# EAGLE design untitled (EAGLE 9.6.2)
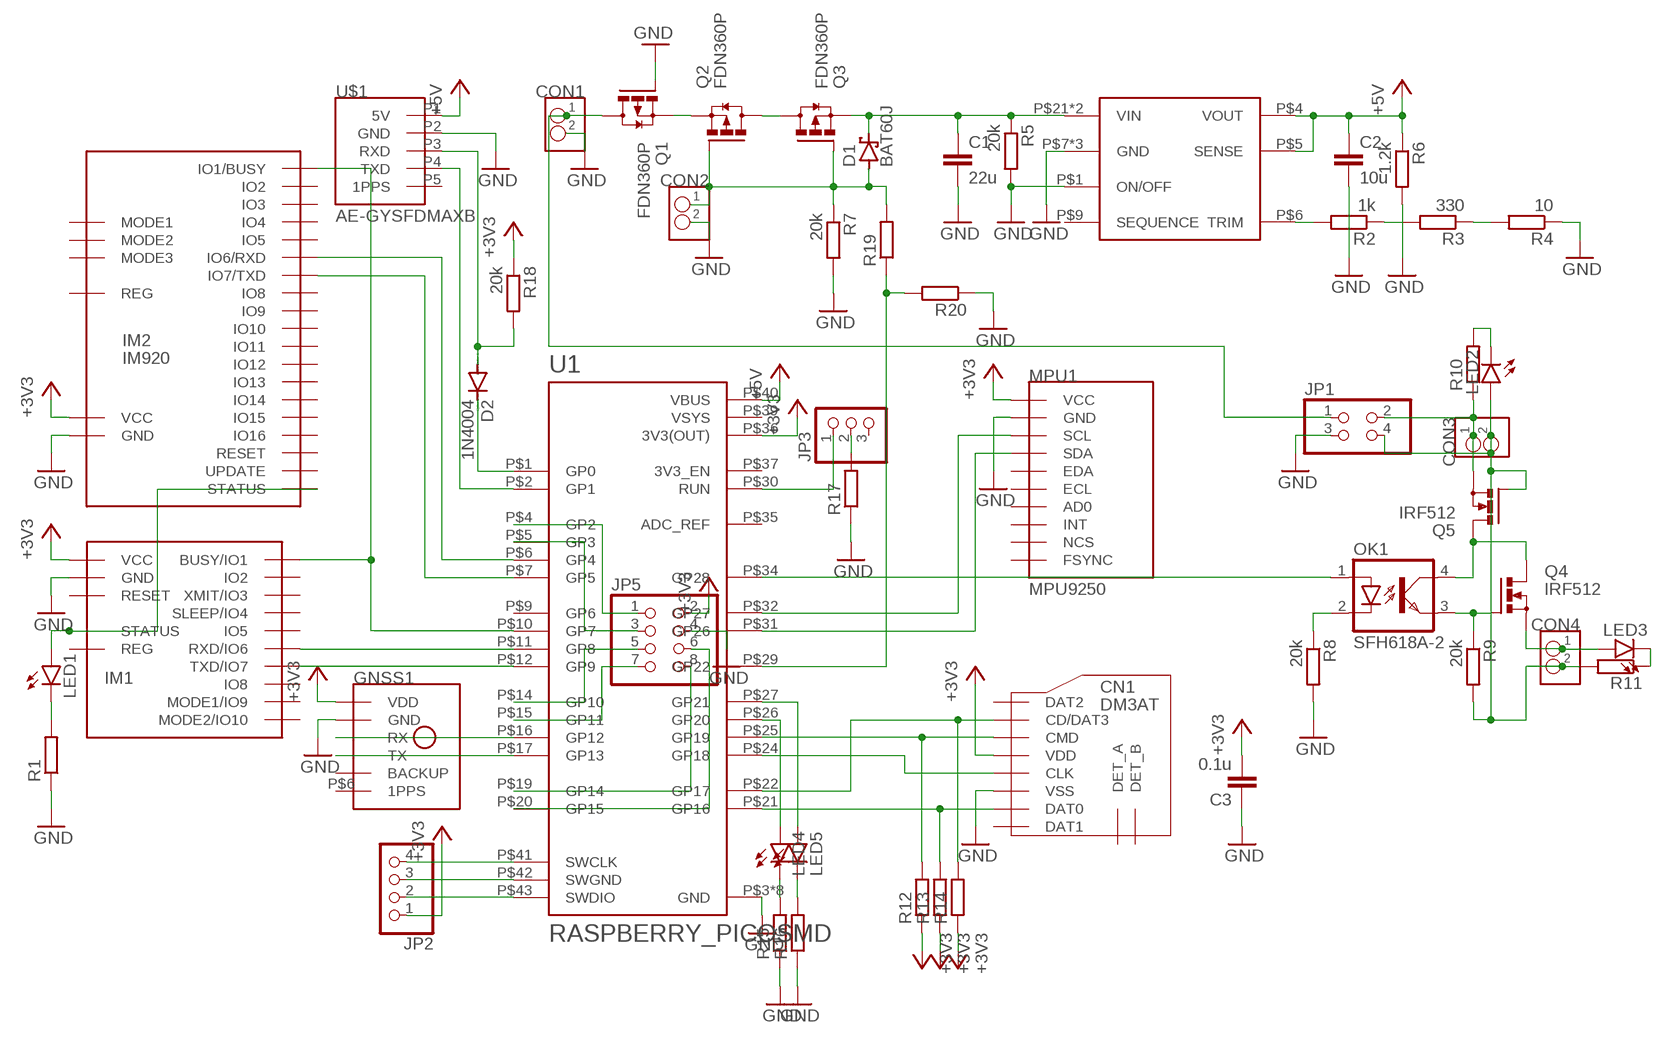
[diagram p0: schematic, sheet 1]

## Parts
C1  22u  C-EUC0805  [C0805]
C2  10u  C-EUC0805  [C0805]
C3  0.1u  C-EUC0805  [C0805]
CN1  DM3AT  [DM3AT]
CON1  B2B-XH-A  [B2B-XH-A]
CON2  B2B-XH-A  [B2B-XH-A]
CON3  B2B-XH-A  [B2B-XH-A]
CON4  B2B-XH-A  [B2B-XH-A]
D1  BAT60J  [SOD323_ST]
D2  1N4004  [DO41-10]
GNSS1  GYSFDMAXB  [GYSFDMAXB]
I1  ＯＫＬ-Ｔ/３-Ｗ５Ｎ-Ｃ  [ＯＫＬ-Ｔ/３-Ｗ５Ｎ-Ｃ]
IM1  IM920C  [IM920C]
IM2  IM920  [IM920]
JP1  PINHD-2X2  [2X02]
JP2  PINHD-1X4  [1X04]
JP3  PINHD-1X3  [1X03]
JP5  PINHD-2X4  [2X04]
LED1  LEDCHIP-LED0805  [CHIP-LED0805]
LED2  LEDCHIP-LED0805  [CHIP-LED0805]
LED3  LEDCHIP-LED0805  [CHIP-LED0805]
LED4  LEDCHIP-LED0805  [CHIP-LED0805]
LED5  LEDCHIP-LED0805  [CHIP-LED0805]
MPU1  MPU9250  [GY-9250]
OK1  SFH618A-2  [DIP4]
Q1  FDN360P  [SUPER-SOT3]
Q2  FDN360P  [SUPER-SOT3]
Q3  FDN360P  [SUPER-SOT3]
Q4  IRF512  [TO220BV]
Q5  IRF512  [TO220BV]
R1  R-EU_R0603  [R0603]
R2  1k  R-EU_R0603  [R0603]
R3  330  R-EU_R0603  [R0603]
R4  10  R-EU_R0603  [R0603]
R5  20k  R-EU_R0603  [R0603]
R6  1.2k  R-EU_R0603  [R0603]
R7  20k  R-EU_R0603  [R0603]
R8  20k  R-EU_R0603  [R0603]
R9  20k  R-EU_R0603  [R0603]
R10  R-EU_R0603  [R0603]
R11  R-EU_R0603  [R0603]
R12  R-EU_R0603  [R0603]
R13  R-EU_R0603  [R0603]
R14  R-EU_R0603  [R0603]
R15  R-EU_R0603  [R0603]
R16  R-EU_R0603  [R0603]
R17  R-EU_R0603  [R0603]
R18  20k  R-EU_R0603  [R0603]
R19  R-EU_R0603  [R0603]
R20  R-EU_R0603  [R0603]
U1  RASPBERRY_PICOSMD  [PICO-PKG-SMD]
U$1  AE-GYSFDMAXB  [AE-GYSFDMAXB]

## Nets
+3V3 [supply]: C3.2 CN1.VDD GNSS1.P$16(VDD) IM1.$P17(VCC) IM2.IO23(VCC) JP2.1 JP5.2 MPU1.P1(VCC) R12.1 R13.1 R14.1 R18.1 U1.P$36(3V3(OUT))
+5V [supply]: C2.1 I1.P$4(VOUT) I1.P$5(SENSE) R6.1 U1.P$40(VBUS) U$1.P1(5V)
GND [supply]: C1.2 C2.2 C3.1 CN1.VSS CON1.P$2 CON2.P$2 GNSS1.P$1(GND) GNSS1.P$2(GND) GNSS1.P$7(GND) GNSS1.P$10(GND) GNSS1.P$12(GND) GNSS1.P$19(GND) GNSS1.P$20(GND) I1.P$1(ON/OFF) I1.P$7(GND) I1.P$31(GND) I1.P$32(GND) IM1.$P18(GND) IM2.IO24(GND) JP1.3 JP5.4 MPU1.P2(GND) Q1.1(G) R1.1 R4.1 R5.2 R6.2 R7.2 R8.2 R15.1 R16.1 R17.1 R20.1 U1.P$3(GND) U1.P$8(GND) U1.P$13(GND) U1.P$18(GND) U1.P$23(GND) U1.P$28(GND) U1.P$33(GND) U1.P$38(GND) U$1.P2(GND)
N$1: CN1.CLK U1.P$24(GP18)
N$2: CN1.DAT0 R13.2 U1.P$21(GP16)
N$3: CN1.CMD R12.2 U1.P$25(GP19)
N$4: CN1.CD/DAT3 R14.2 U1.P$22(GP17)
N$5: MPU1.P4(SDA) U1.P$31(GP26)
N$6: MPU1.P3(SCL) U1.P$32(GP27)
N$7: GNSS1.P$3(RX) U1.P$16(GP12)
N$8: GNSS1.P$5(TX) U1.P$17(GP13)
N$9: IM1.$P6(RXD/IO6) U1.P$11(GP8)
N$10: IM1.$P7(TXD/IO7) U1.P$12(GP9)
N$11: LED1.C R1.2
N$12: IM1.$P15(STATUS) IM2.IO21(STATUS) LED1.A
N$13: IM1.$P1(BUSY/IO1) IM2.IO1(IO1/BUSY) U1.P$10(GP7)
N$14: IM2.IO6(IO6/RXD) U1.P$6(GP4)
N$15: IM2.IO7(IO7/TXD) U1.P$7(GP5)
N$16: U1.P$2(GP1) U$1.P4(TXD)
N$17: D2.C U1.P$1(GP0)
N$18: R2.1 R3.2
N$19: I1.P$6(TRIM) R2.2
N$20: R3.1 R4.2
N$21: CON1.P$1 JP1.1 Q1.3(D)
N$22: C1.1 D1.C I1.P$21(VIN) I1.P$22(VIN) Q3.2(S) R5.1
N$23: Q1.2(S) Q2.2(S)
N$24: Q2.3(D) Q3.3(D)
N$25: R19.1 R20.2 U1.P$29(GP22)
N$26: OK1.2(C) R8.1
N$27: OK1.3(EMIT) Q4.G R9.1
N$28: CON4.P$1 LED3.A Q4.S
N$29: CON3.P$1 JP1.2 Q5.S R10.1
N$30: OK1.4(COL) Q4.D Q5.D
N$31: OK1.1(A) U1.P$34(GP28)
N$32: CON3.P$2 CON4.P$2 JP1.4 LED2.A Q5.G R9.2 R11.2
N$33: LED3.C R11.1
N$34: LED2.C R10.2
N$35: JP2.2 U1.P$43(SWDIO)
N$36: JP2.3 U1.P$42(SWGND)
N$37: JP2.4 U1.P$41(SWCLK)
N$38: JP5.6 U1.P$20(GP15)
N$39: JP5.8 U1.P$19(GP14)
N$40: JP5.7 U1.P$15(GP11)
N$41: JP5.5 U1.P$14(GP10)
N$42: JP5.3 U1.P$5(GP3)
N$43: JP5.1 U1.P$4(GP2)
N$44: LED4.A U1.P$26(GP20)
N$45: LED5.A U1.P$27(GP21)
N$46: LED4.C R15.2
N$47: LED5.C R16.2
N$48: JP3.1 U1.P$30(RUN)
N$49: JP3.2 R17.2
N$50: D2.A R18.2 U$1.P3(RXD)
N$51: CON2.P$1 D1.A Q2.1(G) Q3.1(G) R7.1 R19.2
Unconnected: CN1.DAT1 CN1.DAT2 CN1.DET_A CN1.DET_B GNSS1.P$6(1PPS) GNSS1.P$14(BACKUP) I1.P$9(SEQUENCE) IM1.$P2(IO2) IM1.$P3(XMIT/IO3) IM1.$P4(SLEEP/IO4) IM1.$P5(IO5) IM1.$P8(IO8) IM1.$P9(MODE1/IO9) IM1.$P10(MODE2/IO10) IM1.$P16(REG) IM1.$P19(RESET) IM2.IO2 IM2.IO3 IM2.IO4 IM2.IO5 IM2.IO8 IM2.IO9 IM2.IO10 IM2.IO11 IM2.IO12 IM2.IO13 IM2.IO14 IM2.IO15 IM2.IO16 IM2.IO17(MODE1) IM2.IO18(MODE2) IM2.IO19(MODE3) IM2.IO20(UPDATE) IM2.IO22(REG) IM2.IO25(RESET) JP3.3 MPU1.P5(EDA) MPU1.P6(ECL) MPU1.P7(AD0) MPU1.P8(INT) MPU1.P9(NCS) MPU1.P10(FSYNC) U1.P$9(GP6) U1.P$35(ADC_REF) U1.P$37(3V3_EN) U$1.P5(1PPS)

## Power pins joined to a net without a drawn wire
VSYS: U1.P$39(VSYS)

## Library data of the parts
C1-C3 = rcl:C-EU: CAPACITOR, European symbol; SPICEPREFIX: C
CN1 = microSD:DM3AT
CON1-CON4 = xh2-jst-con:B2B-XH-A
D1 = diode:BAT60J: Schottky barrier diode Source: www.st.com, BAT60J.pdf
D2 = diode:1N4004: DIODE general purpose rectifier, 1 A
GNSS1 = GYSFDMAXB:GYSFDMAXB
I1 = untitled:ＯＫＬ-Ｔ/３-Ｗ５Ｎ-Ｃ
IM1 = IM920:IM920C
IM2 = IM920:IM920
JP1 = pinhead:PINHD-2X2: PIN HEADER
JP2 = pinhead:PINHD-1X4: PIN HEADER
JP3 = pinhead:PINHD-1X3: PIN HEADER
JP5 = pinhead:PINHD-2X4: PIN HEADER
LED1-LED5 = led:LED: LED OSRAM: - CHIPLED LG R971, LG N971, LY N971, LG Q971, LY Q971, LO R971, LY R971 LH N974, LH R974 LS Q976, LO Q976, LY Q976 LO Q996 - Hyper CHIPLED LW Q18S LB Q993, LB Q99A, LB R99A - SideLED LS A670, LO A670, LY A670, LG A670, LP A670 LB A673, LV A673, LT A673, LW A673 LH A674 LY A675 LS A676, LA A676, LO A676, LY A676, LW A676 LS A679, LY A679, LG A679 - Hyper Micro SIDELED® LS Y876, LA Y876, LO Y876, LY Y876 LT Y87S - SmartLED LW L88C, LW L88S LB L89C, LB L89S, LG L890 LS L89K, LO L89K, LY L89K LS L896, LA L896, LO L896, LY L896 - TOPLED LS T670, LO T670, LY T670, LG T670, LP T670 LSG T670, LSP T670, LSY T670, LOP T670, LYG T670 LG T671, LOG T671, LSG T671 LB T673, LV T673, LT T673, LW T673 LH T674 LS T676, LA T676, LO T676, LY T676, LB T676, LH T676, LSB T676, LW T676 LB T67C, LV T67C, LT T67C, LS T67K, LO T67K, LY T67K, LW E67C LS E67B, LA E67B, LO E67B, LY E67B, LB E67C, LV E67C, LT E67C LW T67C LS T679, LY T679, LG T679 LS T770, LO T770, LY T770, LG T770, LP T770 LB T773, LV T773, LT T773, LW T773 LH T774 LS E675, LA E675, LY E675, LS T675 LS T776, LA T776, LO T776, LY T776, LB T776 LHGB T686 LT T68C, LB T68C - Hyper Mini TOPLED® LB M676 - Mini TOPLED Santana® LG M470 LS M47K, LO M47K, LY M47K Source: http://www.osram.convergy.de LUXEON: - LUMILED® LXK2-PW12-R00, LXK2-PW12-S00, LXK2-PW14-U00, LXK2-PW14-V00 LXK2-PM12-R00, LXK2-PM12-S00, LXK2-PM14-U00 LXK2-PE12-Q00, LXK2-PE12-R00, LXK2-PE12-S00, LXK2-PE14-T00, LXK2-PE14-U00 LXK2-PB12-K00, LXK2-PB12-L00, LXK2-PB12-M00, LXK2-PB14-N00, LXK2-PB14-P00, LXK2-PB14-Q00 LXK2-PR12-L00, LXK2-PR12-M00, LXK2-PR14-Q00, LXK2-PR14-R00 LXK2-PD12-Q00, LXK2-PD12-R00, LXK2-PD12-S00 LXK2-PH12-R00, LXK2-PH12-S00 LXK2-PL12-P00, LXK2-PL12-Q00, LXK2-PL12-R00 Source: www.luxeon.com KINGBRIGHT: KA-3528ASYC Source: www.kingbright.com
MPU1 = MPU9250:MPU9250
OK1 = optocoupler:SFH618?*: Optocoupler, Phototransistor Output, Low Input Current Source: Data sheet <http://www.vishay.com/docs/83673/sfh618.pdf>; MF: VISHAY/TELEFUNKEN; MPN: SFH618A-2; OC_FARNELL: 6424855; OC_NEWARK: 21H7744
Q1-Q3 = transistor-power:FDN360P: Single P-Channel, PowerTrench (R) MOSFET Source: http://www.fairchildsemi.com/ds/FD/FDN360P.pdf
Q4 Q5 = transistor-power:IRF512: N-CHANNEL MOS FET
R1-R20 = rcl:R-EU_: RESISTOR, European symbol; SPICEPREFIX: R
U1 = RpiPico:RASPBERRY_PICO: Raspberry Pi Pico
U$1 = AE-GYSFDMAXB:AE-GYSFDMAXB

## Net classes
1 supply: width 0.305 mm

## Board
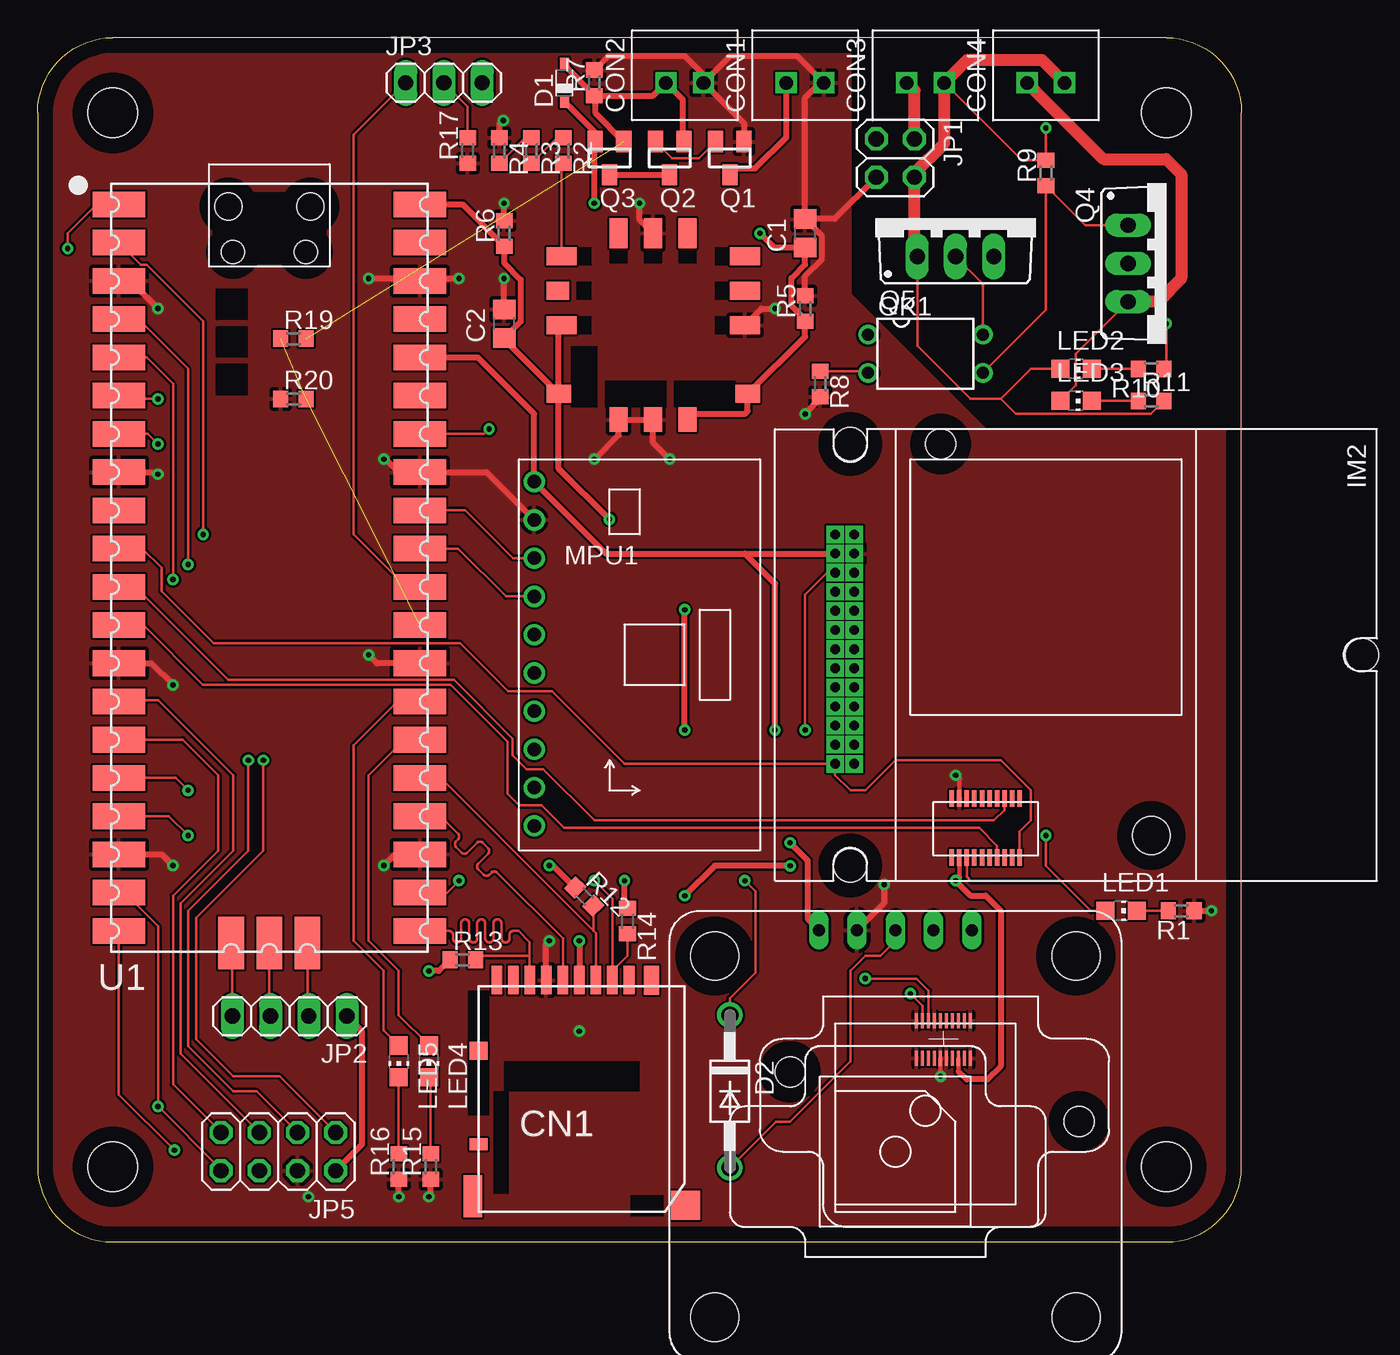
[diagram p1: board, top side]
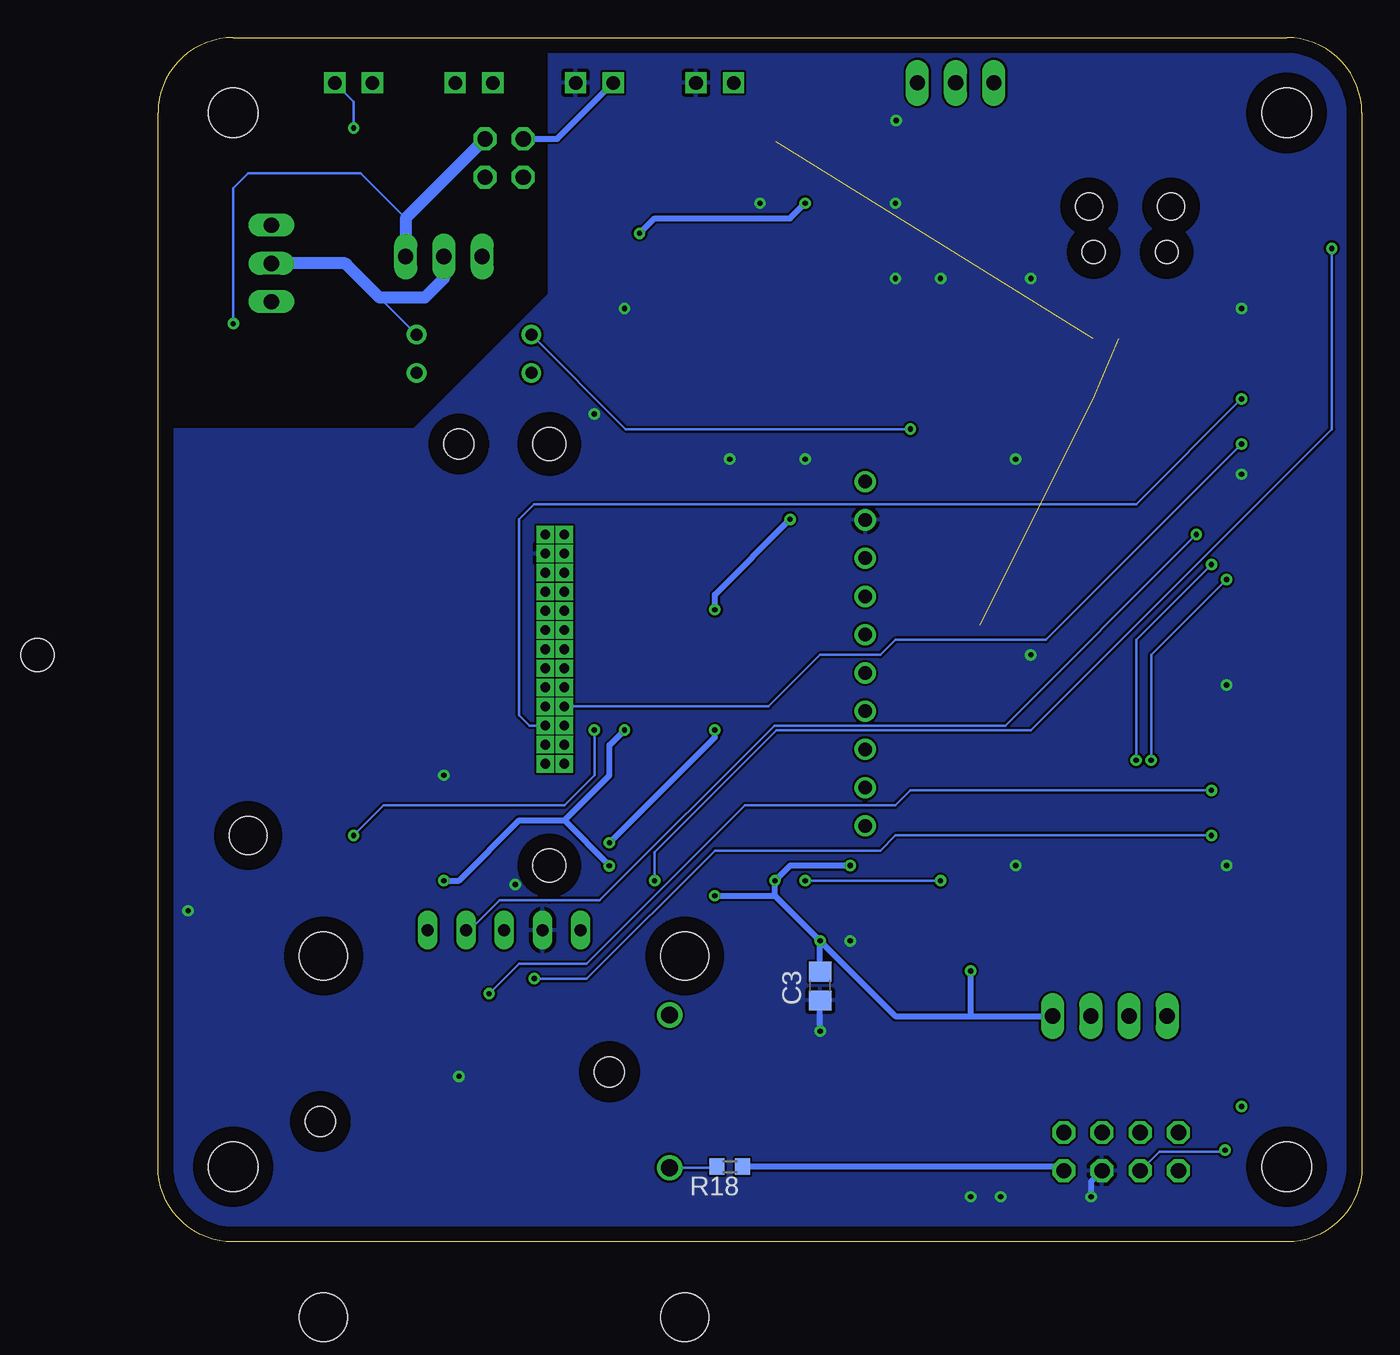
[diagram p2: board, bottom side, seen from below]

Size 80 x 80 mm. Coordinates in mm from the lower left corner, seen from the top.
Outline: 5,0 75,0 arc90 80,5 80,75 arc90 75,80 5,80 arc90 0,75 0,5 arc90 5,0
Copper layers (1*16): Top 0.035mm / dielectric 1.5mm / Bottom 0.035mm
Design rules "default": minimum track width 6mil, minimum drill 0.35mm, track to track 6mil, track to pad 6mil, pad to pad 6mil, via to via 6mil, smd to smd 6mil, copper to edge 40mil, drill to drill 6mil, minimum pad ring 10mil, minimum via ring 8mil, stop-mask expansion 4mil, vias tented up to drill 0mil, thermal gap 10mil
Holes 3.3 mm at 5,75 5,5 75,5 75,75

### Footprints (pad centres in the part's own frame; a part is rotated, then mirrored left to right if it is on the bottom)
C0805 = smd 1.3 x 1.5: 1 -0.95,0; 2 0.95,0
DM3AT = smd 0.7 x 1.9: CD/DAT3 2.2,6.4; CLK -1.1,6.4; CMD 1.1,6.4; DAT0 -3.3,6.4; DAT1 -4.4,6.4; DAT2 3.3,6.4; DET_B -5.5,6.4; VDD 0,6.4; VSS -2.2,6.4 | smd 1.2 x 0.8: DET_A -6.7,-4.5 | smd 1 x 1.9: P$9 4.8,6.381 | smd 1.2 x 1.2: P$11 -6.7,1.7 | smd 1.2 x 2.8: P$13 -7.081,-7.973 | smd 1.9 x 1.9: P$14 7.054,-8.562
B2B-XH-A = drill 0.9 square: P$1 0,1.25; P$2 0,-1.25
SOD323_ST = smd 0.8 x 0.6: A 1.25,0; C -1.25,0
DO41-10 = drill 1.118: A 5.08,0; C -5.08,0
GYSFDMAXB = smd 0.2 x 1: P$1 8.4,6.7; P$2 8.4,4.2; P$3 8.8,6.7; P$4 8.8,4.2; P$5 9.2,6.7; P$6 9.2,4.2; P$7 9.6,6.7; P$8 9.6,4.2; P$9 10,6.7; P$10 10,4.2; P$11 10.4,6.7; P$12 10.4,4.2; P$13 10.8,6.7; P$14 10.8,4.2; P$15 11.2,6.7; P$16 11.2,4.2; P$17 11.6,6.7; P$18 11.6,4.2; P$19 12,6.7; P$20 12,4.2 | hole 2: 0,3.3; 19.2,0
ＯＫＬ-Ｔ/３-Ｗ５Ｎ-Ｃ = smd 2 x 1.2: P$1 0,6.1; P$5 12.19,6.1; P$6 12.19,1.52; P$9 0,1.52; P$10 0,3.81 | smd 1.63 x 1.2: P$4 12.375,10.67; P$21 -0.185,10.67 | smd 1.2 x 2: P$7 6.1,0; P$8 3.81,0; P$12 8.39,0 | smd 1.5 x 1.2: P$11 12.44,3.81 | smd 1.2 x 1.63: P$22 3.81,12.375; P$31 6.1,12.375; P$32 8.39,12.375
IM920C = smd 0.3 x 1.1: $P1 -1.75,-13.45; $P2 -1.75,-9.55; $P3 -2.25,-13.45; $P4 -2.25,-9.55; $P5 -2.75,-13.45; $P6 -2.75,-9.55; $P7 -3.25,-13.45; $P8 -3.25,-9.55; $P9 -3.75,-13.45; $P10 -3.75,-9.55; $P11 -4.25,-13.45; $P12 -4.25,-9.55; $P13 -4.75,-13.45; $P14 -4.75,-9.55; $P15 -5.25,-13.45; $P16 -5.25,-9.55; $P17 -5.75,-13.45; $P18 -5.75,-9.55; $P19 -6.25,-13.45; $P20 -6.25,-9.55 | hole 2.5: 7,-12 | hole 2: -7,14
IM920 = drill 0.65 square: IO1 7.24,-16; IO2 7.24,-14.73; IO3 5.97,-16; IO4 5.97,-14.73; IO5 4.7,-16; IO6 4.7,-14.73; IO7 3.43,-16; IO8 3.43,-14.73; IO9 2.16,-16; IO10 2.16,-14.73; IO11 0.89,-16; IO12 0.89,-14.73; IO13 -0.38,-16; IO14 -0.38,-14.73; IO15 -1.65,-16; IO16 -1.65,-14.73; IO17 -2.92,-16; IO18 -2.92,-14.73; IO19 -4.19,-16; IO20 -4.19,-14.73; IO21 -5.46,-16; IO22 -5.46,-14.73; IO23 -6.73,-16; IO24 -6.73,-14.73; IO25 -8,-16; IO26 -8,-14.73 | hole 2.2: -14,-15; 14,-15; 0,19
2X02 = drill 1.016 octagon: 1 -1.27,-1.27; 2 -1.27,1.27; 3 1.27,-1.27; 4 1.27,1.27
1X04 = drill 1.016 long: 1 -3.81,0; 2 -1.27,0; 3 1.27,0; 4 3.81,0
1X03 = drill 1.016 long: 1 -2.54,0; 2 0,0; 3 2.54,0
2X04 = drill 1.016 octagon: 1 -3.81,-1.27; 2 -3.81,1.27; 3 -1.27,-1.27; 4 -1.27,1.27; 5 1.27,-1.27; 6 1.27,1.27; 7 3.81,-1.27; 8 3.81,1.27
CHIP-LED0805 = smd 1.2 x 1.2: A 0,-1.05; C 0,1.05
GY-9250 = drill 0.9: P1 -7,11.5; P2 -7,8.96; P3 -7,6.42; P4 -7,3.88; P5 -7,1.34; P6 -7,-1.2; P7 -7,-3.74; P8 -7,-6.28; P9 -7,-8.82; P10 -7,-11.36
DIP4 = drill 0.8: 1 -1.27,-3.81; 2 1.27,-3.81; 3 1.27,3.81; 4 -1.27,3.81
SUPER-SOT3 = smd 1 x 1.4: 1 -0.95,-1.1; 2 0.95,-1.1; 3 0,1.1
TO220BV = drill 1.016 long: D 0,-2.54; G -2.54,-2.54; S 2.54,-2.54
R0603 = smd 1 x 1.1: 1 -0.85,0; 2 0.85,0
PICO-PKG-SMD = smd 3.5 x 1.7: P$1 -10,24.13; P$2 -10,21.59; P$3 -10,19.05; P$4 -10,16.51; P$5 -10,13.97; P$6 -10,11.43; P$7 -10,8.89; P$8 -10,6.35; P$9 -10,3.81; P$10 -10,1.27; P$11 -10,-1.27; P$12 -10,-3.81; P$13 -10,-6.35; P$14 -10,-8.89; P$15 -10,-11.43; P$16 -10,-13.97; P$17 -10,-16.51; P$18 -10,-19.05; P$19 -10,-21.59; P$20 -10,-24.13; P$21 10,-24.13; P$22 10,-21.59; P$23 10,-19.05; P$24 10,-16.51; P$25 10,-13.97; P$26 10,-11.43; P$27 10,-8.89; P$28 10,-6.35; P$29 10,-3.81; P$30 10,-1.27; P$31 10,1.27; P$32 10,3.81; P$33 10,6.35; P$34 10,8.89; P$35 10,11.43; P$36 10,13.97; P$37 10,16.51; P$38 10,19.05; P$39 10,21.59; P$40 10,24.13 | smd 1.7 x 3.5: P$41 -2.54,-24.925; P$42 0,-24.925; P$43 2.54,-24.925 | hole 1.8: -2.725,24; 2.725,24 | hole 1.5: -2.425,20.97; 2.425,20.97
AE-GYSFDMAXB = drill 0.8 long: P1 13.716,5.08; P2 13.716,2.54; P3 13.716,0; P4 13.716,-2.54; P5 13.716,-5.08 | hole 3.2: -12,12; 12,12; 12,-12; -12,-12

### Placement (x,y rotation side)
C1  51,67 90 top
C2  31,61 90 top
C3  36,17 90 bottom
CN1  36,11 0 top
CON1  51,77 90 top
CON2  43,77 90 top
CON3  59,77 90 top
CON4  67,77 90 top
D1  35,77 90 top
D2  46,10 270 top
GNSS1  50,8 0 top
I1  47,67 180 top
IM1  67,39 0 top
IM2  69,39 270 top
JP1  57,72 270 top
JP2  16.75,15 180 top
JP3  27,77 0 top
JP5  16,6 180 top
LED1  72,22 270 top
LED2  69,58 270 top
LED3  69,55.87 270 top
LED4  26,12 180 top
LED5  24,12 180 top
MPU1  40,39 0 top
OK1  59,59 270 top
Q1  46,72 180 top
Q2  42,72 180 top
Q3  38,72 180 top
Q4  75,65 270 top
Q5  61,68 0 top
R1  76,22 180 top
R2  34.94,72.5 270 top
R3  32.81,72.5 270 top
R4  30.69,72.5 270 top
R5  51,62 90 top
R6  31,67 90 top
R7  37,77 90 top
R8  52,57 270 top
R9  67,71 90 top
R10  74,58 180 top
R11  74,55.87 0 top
R12  36.33,22.94 315 top
R13  28.25,18.75 0 top
R14  39.2,21.31 270 top
R15  26.13,5 90 top
R16  24,5 90 top
R17  28.57,72.5 90 top
R18  42,5 180 bottom
R19  17,60 0 top
R20  17,56 0 top
U1  15.4,44.79 0 top
U$1  57,7 90 top

### Tracks (layer width: path | path; a pad name or v marks a point on that pad's centre or on a via)
+3V3  (via drill 0.35)
  Top 0.305: IM1.$P17 61.25,24.25 | GNSS1.P$16 61.2,11.32
  Top 0.406: 61.25,24.25 v61,24 62,23 63,23 64,22 64,11.68 63.12,10.79 61.72,10.79 61.2,11.32 | v43,23 45,25 50,25 v50.02,24.98 | v36,20 CN1.VDD | JP2.1 21.56,14 21.56,6.48 JP5.2 | 47,45.73 37.77,45.73 MPU1.P1 33,55 29.24,58.76 U1.P$36 | 47,45.73 IM2.IO23 | 47,45.73 49,43.73 v49,34 | R14.1 39,22.36 v39,24 | R13.1 26.66,18 v26,18 | R12.1 34.27,25 v34,25
  Bottom 0.406: C3.2 v36,20 | v36,20 39,23 | v43,23 39,23 | v36,20 31,15 26,15 | 26,15 JP2.1 | JP5.2 20.08,5 R18.1 | v49,34 50,33 50,31 53,28 | 39,23 v39,24 38,25 v34,25 | v26,18 26,15 | v61,24 60,24 56,28 53,28 | 53,28 50.02,25.02 v50.02,24.98
+5V  (via drill 0.35)
  Top 0.406: U1.P$40 28.23,68.92 R6.1 31,65.04 32.11,63.93 32.11,61.15 31.02,60.07 C2.1 31.02,60.02 31.02,59.93 I1.P$4 | 34.62,56.42 I1.P$4 | I1.P$4 34.62,60.72 I1.P$5 | U$1.P1 51.17,21.46 51.17,25.35 v50,26.52 | v43,34 v43,42 | v38,48 34.62,51.38 I1.P$4
  Bottom 0.406: v50,26.52 43,33.52 v43,34 | v43,42 43,43 v38,48
GND  (via drill 0.35)
  Top 0.305: v60,11 60,11.57 60.01,11.57 GNSS1.P$10 | IM1.$P18 61.25,30.75
  Top 0.406: 61.25,30.75 v61,31 | CN1.VSS 33.8,19.8 v34,20 | U1.P$18 8.26,25.74 v9,25 | U1.P$13 7.56,38.44 v9,37 | U1.P$8 7.86,51.14 v8,51 | U1.P$3 6.16,63.84 v8,62 | v22,64 25.84,64 26,63.84 | U1.P$38 25.56,64 v28,64 | C2.2 v31,64 | I1.P$7 40,67.9 v40,69 | C1.2 52.11,66.85 52.11,65.25 51,64.15 R5.2 | C1.2 | C1.2 51,76 52,77 CON1.P$2 50.47,78.78 46.03,78.78 CON2.P$2 | JP1.3 52.95,67.95 C1.2 | R7.2 37.93,78.78 43,78.78 44.25,77.53 CON2.P$2 | CON2.P$2 46.95,74.3 Q1.1 | R4.1 30.69,74.25 v30.94,74.5 | R6.2 v31,69 | U1.P$23 23.74,25.74 v23,25 | R1.1 v78,22 | U1.P$28 22.56,38.44 v22,39 | v26,3 26.13,3.13 R15.1 | v24,3 R16.1 | v23,52 23.14,52 24,51.14 U1.P$33 29.82,51.14 MPU1.P2 | v42,52 40.9,53.1 I1.P$31 I1.P$32 38.61,53.61 v37,52 | I1.P$1 48.1,62 v49,62 | v51,55 52,56 R8.2 | U$1.P2 56.26,22.52 v56.26,23.74
  Bottom 0.406: JP5.4 18,4 v18,3 | v36,14 C3.1
  pour Top: 0,80 53,80 54,79 54,63 63,54 80,54 80,0 0,0
  pour Bottom: 0,80 53,80 54,79 54,63 63,54 80,54 80,0 1,0 0,1
N$1
  Top 0.152: CN1.CLK 34.9,20.16 30.53,24.53 arc90 30.15,24.53 30.02,24.39 arc-90 29.64,24.39 29.28,24.75 arc-90 29.28,25.13 29.93,25.78 arc90 29.93,26.16 29.57,26.52 arc90 29.2,26.52 28.54,25.87 arc-90 28.17,25.87 27.81,26.23 arc-90 27.81,26.6 27.95,26.74 arc90 27.95,27.12 26.78,28.28 U1.P$24
N$2
  Top 0.152: CN1.DAT0 32.7,19 | 32.7,19 32.7,19.92 31.96,20.66 31.62,20.66 arc90 31.36,20.39 31.36,20.16 arc-90 31.09,19.89 31.09,19.89 arc-90 30.82,20.16 30.82,21.16 arc90 30.55,21.43 30.55,21.43 arc90 30.29,21.16 30.29,20.16 arc-90 30.02,19.89 30.02,19.89 arc-90 29.75,20.16 29.75,21.16 arc90 29.48,21.43 29.48,21.43 arc90 29.21,21.16 29.21,20.16 arc-90 28.95,19.89 28.95,19.89 arc-90 28.68,20.16 28.68,21.16 arc90 28.41,21.43 28.41,21.43 arc90 28.14,21.16 28.14,20.16 arc-90 27.88,19.89 27.88,19.89 arc-90 27.61,20.16 27.61,20.39 arc90 27.34,20.66 U1.P$21 | R13.2 29.36,19 32.7,19
N$3
  Top 0.152: 36.93,20.68 26.78,30.82 U1.P$25 | CN1.CMD 37.1,20.5 36.93,20.68 | R12.2 36.93,20.68
N$4  (via drill 0.35)
  Top 0.152: CN1.CD/DAT3 38.2,18 | 38.2,18 38.2,22.8 v37,24 | U1.P$22 27.2,23.2 v28,24 | R14.2 39.2,19 38.2,18
  Bottom 0.152: v37,24 v28,24
N$5
  Top 0.152: MPU1.P4 31.12,42.88 27.94,46.06 U1.P$31
N$6
  Top 0.152: MPU1.P3 31.58,45.42 28.4,48.6 U1.P$32
N$7  (via drill 0.35)
  Top 0.152: U1.P$16 9.18,30.82 v10,30 | GNSS1.P$3 58.8,15.69 v58,16.49
  Bottom 0.152: v10,30 30,30 31,29 41,29 51.51,18.49 56,18.49 v58,16.49
N$8  (via drill 0.35)
  Top 0.152: GNSS1.P$5 59.2,16.7 58.41,17.49 v55,17.49 | v10,27 8.72,28.28 U1.P$17
  Bottom 0.152: v55,17.49 51.51,17.49 43,26 32,26 31,27 v10,27
N$9
  Top 0.152: IM1.$P6 64.25,28.69 63.56,28 36.99,28 33.59,31.41 32.49,31.41 31.56,32.33 31.56,33.43 27.66,37.33 12.67,37.33 6.48,43.52 U1.P$11
N$10
  Top 0.152: IM1.$P7 63.75,26.33 62.57,27.51 34.97,27.51 33.48,29 32,29 31.24,29.76 31.24,33.24 27.45,37.03 10.97,37.03 7,41 5.42,41 U1.P$12
N$11
  Top 0.152: LED1.C R1.2
N$12  (via drill 0.35)
  Top 0.152: IM1.$P15 61.75,24.25 62,24 68,24 | LED1.A 70,22 68,24 | 68,24 67,25 v67,27 | v51,34 51,43 52.46,44.46 IM2.IO21
  Bottom 0.152: v51,34 51,31 53,29 65,29 v67,27
N$13
  Top 0.152: IM1.$P1 65.25,27.25 66,28 66,30 64,32 57,32 55,30 54,30 53,31 IM2.IO1 39,31.76 34.18,36.58 31.25,36.58 28.06,39.77 11.69,39.77 8.23,43.23 8.23,44.77 6.94,46.06 U1.P$10
N$14  (via drill 0.35)
  Top 0.152: v8,56 5.62,56 U1.P$6
  Bottom 0.152: IM2.IO6 55.3,34.3 56,35 56,48 55,49 15,49 v8,56
N$15  (via drill 0.35)
  Top 0.152: v8,53 7.32,53.68 U1.P$7
  Bottom 0.152: IM2.IO7 39.43,35.57 36,39 32,39 31,40 21,40 v8,53
N$16  (via drill 0.35)
  Top 0.152: U1.P$2 6.86,64.92 7.25,64.92 11,61.16 v11,47
  Bottom 0.152: v11,47 23.7,34.3 39.03,34.3 50.65,22.68 54,22.68 57.32,22.68 59.28,20.72 U$1.P4
N$17  (via drill 0.35)
  Top 0.152: v2,66 2,67 3.92,68.92 U1.P$1 | D2.C 46,16.19 47.69,17.89 47.69,23.31 v47,24
  Bottom 0.152: v2,66 2,54 22,34 38.9,34 47,25.9 v47,24
N$18
  Top 0.152: R3.2 34.51,73.35 R2.1
N$19
  Top 0.152: R2.2 34.81,71.52 I1.P$6
N$20
  Top 0.152: R4.2 32.39,73.35 R3.1
N$21
  Top 0.406: Q1.3 46.41,71.31 47.69,71.31 49.75,73.38 CON1.P$1
  Bottom 0.406: JP1.1 53.48,73.27 CON1.P$1
N$22  (via drill 0.35)
  Top 0.152: Q3.2 37.05,73.7 D1.C | 37,73 v37,69
  Top 0.406: D1.C 37,73.75 37,73 | I1.P$22 43.56,55 47,55 47.19,55.19 I1.P$21 51,60.15 R5.1 51,61.3 50.09,62.2 50.09,64.03 51,64.94 C1.1 48.95,66.05 v48,67 | v37,69 37,73.05 Q3.2
  Bottom 0.406: v48,67 47,68 38,68 v37,69
N$23
  Top 0.152: Q2.2 42.15,72 43.95,72 Q1.2
N$24
  Top 0.406: Q3.3 Q2.3
N$25  (2 unrouted)
N$26
  Top 0.152: OK1.2 55.07,57.85 R8.1
N$27
  Top 0.152: Q4.G 69.61,67.54 R9.1 67,61.92 OK1.3
N$28
  Top 0.152: LED3.A 69,56.92 69,59 Q4.S
  Top 0.813: CON4.P$1 70.82,71.93 75,71.93 76,70.93 76,64 74.46,62.46 Q4.S
N$29  (via drill 0.35)
  Top 0.152: v75,61 75,58.15 R10.1
  Top 0.813: JP1.2 58.27,76.48 CON3.P$1
  Bottom 0.152: 63.54,68 66.54,71 74,71 75,70 v75,61
  Bottom 0.813: JP1.2 63.54,68 Q5.S
N$30
  Top 0.152: Q5.D 62.81,63.65 OK1.4
  Bottom 0.152: OK1.4 65.27,62.73
  Bottom 0.406: 62,63 61,64
  Bottom 0.813: Q5.D 61,64 62.27,62.73 65.27,62.73 67.27,64.73 67.54,65 Q4.D
N$31  (via drill 0.35)
  Top 0.152: v30,54 29.68,53.68 U1.P$34
  Bottom 0.152: OK1.1 48.92,54 v30,54
N$32  (via drill 0.35)
  Top 0.152: LED2.A 66,58 64,56 | 64,56 62,56 58.46,59.54 Q5.G | R11.2 73.98,55 65,55 64,56 | v67,74 R9.2 65.4,71.85 CON3.P$2
  Top 0.61: 61.78,78.53 62,78.53
  Top 0.813: Q5.G 58.27,65.65 JP1.4 58.27,71.02 60.25,73 CON3.P$2 61.78,78.53 | 62,78.53 66.72,78.53 CON4.P$2
  Bottom 0.152: v67,74 67,75.75 CON4.P$2
N$33
  Top 0.152: R11.1 LED3.C
N$34
  Top 0.152: LED2.C R10.2
N$35
  Top 0.152: U1.P$43 17.94,15.08 JP2.2
N$36
  Top 0.152: U1.P$42 15.4,15.08 JP2.3
N$37
  Top 0.152: U1.P$41 12.94,19.79 JP2.4
N$38  (via drill 0.35)
  Top 0.152: U1.P$20 5.4,9.79 v9.1,6.09
  Bottom 0.152: v9.1,6.09 9.19,6 13.46,6 JP5.6
N$39  (via drill 0.35)
  Top 0.152: U1.P$19 5.78,23.2 8,20.98 v8,9 12,5 12,4.92 JP5.8
N$40
  Top 0.152: U1.P$15 9.64,33.36 12,31 12,26 9,23 9,10.46 JP5.7
N$41
  Top 0.152: JP5.5 9.49,12.51 9.49,22.49 13,26 13,31 8,36 5.5,36 U1.P$14
N$42  (via drill 0.35)
  Top 0.152: JP5.3 14.54,10 13,10 10,13 10,22 14,26 v14,32 | v9,44 9,57 7.24,58.76 U1.P$5
  Bottom 0.152: v9,44 14,39 v14,32
N$43  (via drill 0.35)
  Top 0.152: JP5.1 16.08,11 13,11 10.54,13.46 10.54,21.54 15,26 v15,32 | v10,45 10,58 7,61 5.7,61 U1.P$4
  Bottom 0.152: v15,32 15,40 v10,45
N$44
  Top 0.152: LED4.A 24,15.05 24,18 22,20 22,31 24.36,33.36 U1.P$26
N$45
  Top 0.152: LED5.A 23,14.05 23,18 21,20 21,33 23.9,35.9 U1.P$27
N$46
  Top 0.152: LED4.C 26.13,10.82 R15.2
N$47
  Top 0.152: R16.2 LED5.C
N$48
  Top 0.152: JP3.1 21,73.54 21,47 24.48,43.52 U1.P$30
N$49
  Top 0.152: JP3.2 28.57,75.42 R17.2
N$50
  Top 0.152: D2.A 49.08,8 50,8 54,12 54,18 55,19 56,19 57,20 U$1.P3
  Bottom 0.152: D2.A 42.93,4.92 R18.2
N$51  (1 unrouted)
  Top 0.152: Q2.1 42.95,73.72 | R7.1 37.08,76.08
  Top 0.406: Q2.1 42.88,73.17 42.88,75.88 CON2.P$1 40.9,76.15 R7.1 35,78.15 D1.A | Q3.1 37.08,74.97 37.08,76.08